# EAGLE design ktirBase (EAGLE 8.1.0)
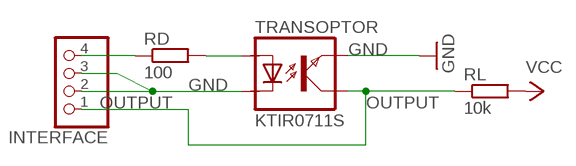
[diagram p0: schematic, sheet 1]

## Parts
INTERFACE  PINHD-1X4/90  [1X04/90]
RD  100  R-EU_0204/7  [0204/7]
RL  10k  R-EU_0204/7  [0204/7]
TRANSOPTOR  KTIR0711S  [TOP]

## Nets
ANODE: RD.2 TRANSOPTOR.ANODA
GND: INTERFACE.2 INTERFACE.3 TRANSOPTOR.EMITER TRANSOPTOR.KATODA
OUTPUT: INTERFACE.1 RL.1 TRANSOPTOR.KOLEKTOR
VCC: INTERFACE.4 RD.1 RL.2

## Library data of the parts
INTERFACE = pinhead:PINHD-1X4: PIN HEADER
RD RL = resistor:R-EU_: RESISTOR, European symbol
TRANSOPTOR = KTIR0711S:KTIR0711S

## Board
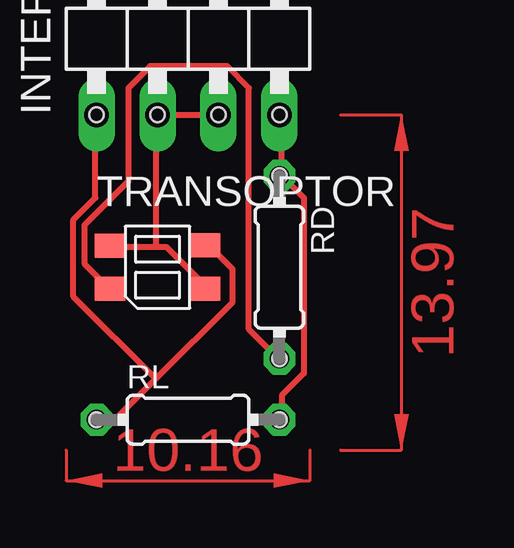
[diagram p1: board, top side]

No outline drawn. Coordinates in mm, seen from the top.
Copper layers (1*16): Top 0.035mm / dielectric 1.5mm / Bottom 0.035mm
Design rules "default": minimum track width 10mil, minimum drill 24mil, track to track 8mil, track to pad 8mil, pad to pad 8mil, via to via 8mil, smd to smd 8mil, copper to edge 40mil, drill to drill 8mil, minimum pad ring 10mil, minimum via ring 8mil, stop-mask expansion 4mil, vias tented up to drill 0mil, thermal gap 10mil
Holes 0.6 mm at 5.08,13.97 7.62,13.97 10.16,13.97 12.7,13.97 12.7,11.43 12.7,3.81 12.7,1.27 5.08,1.27

### Footprints (pad centres in the part's own frame; a part is rotated, then mirrored left to right if it is on the bottom)
1X04/90 = drill 1.016 long: 1 -3.81,-3.81; 2 -1.27,-3.81; 3 1.27,-3.81; 4 3.81,-3.81
0204/7 = drill 0.813 octagon: 1 -3.81,0; 2 3.81,0
TOP = smd 1.27 x 1: ANODA -1.985,-0.9; EMITER -1.985,0.9; KATODA 1.985,-0.9; KOLEKTOR 1.985,0.91

### Placement (x,y rotation side)
INTERFACE  8.89,17.78 0 top
RD  12.7,7.62 270 top
RL  8.89,1.27 0 top
TRANSOPTOR  7.62,7.62 0 top

### Tracks (layer width: path | path; a pad name or v marks a point on that pad's centre or on a via)
ANODE
  Top 0.254: TRANSOPTOR.ANODA 5.49,6.86 4.57,7.77 4.57,9.37 6.4,11.2 6.4,15.09 7.32,16 10.52,16 11.43,15.09 11.43,5.03 12.57,3.89 RD.2
GND
  Top 0.254: 7.54,8.46 8,8.46 9.6,6.86 TRANSOPTOR.KATODA | 7.54,8.46 5.71,8.46 TRANSOPTOR.EMITER | INTERFACE.3 10.06,13.95 7.77,13.95 INTERFACE.2 7.54,13.95 7.54,8.46
OUTPUT
  Top 0.254: 7.54,2.97 5.94,1.37 5.26,1.37 RL.1 | 7.54,2.97 10.74,6.17 10.74,7.54 9.83,8.46 TRANSOPTOR.KOLEKTOR | 7.54,2.97 4.12,6.4 4.12,9.6 5.03,10.52 5.03,13.95 INTERFACE.1
VCC
  Top 0.254: 12.8,11.43 13.72,10.52 13.72,3.2 12.8,2.29 12.8,1.37 RL.2 | 12.8,11.43 12.8,13.95 INTERFACE.4 | 12.8,11.43 RD.1
(copper drawn outside any net)
  shapes: Top area x2